# EAGLE design steerstick_power (EAGLE 9.6.2)
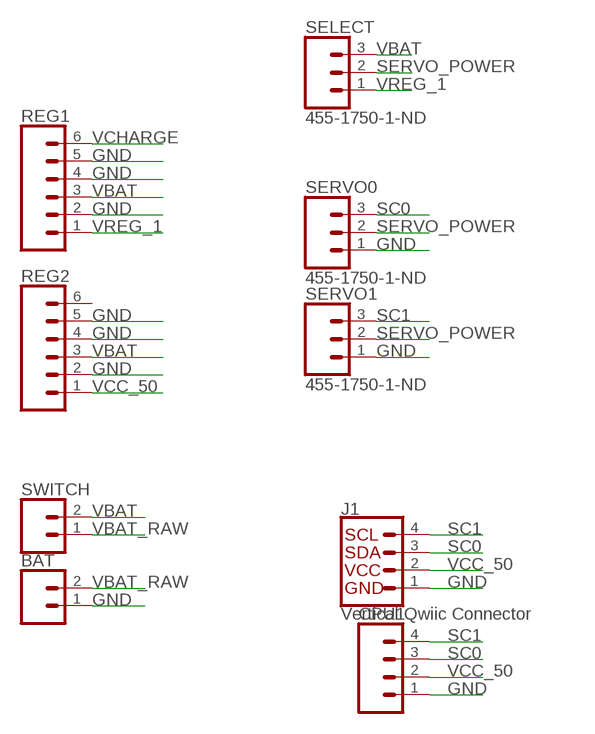
[diagram p0: schematic, sheet 1]

## Parts
BAT  CONN_02  [1X02]
CPU1  CONN_041X04_NO_SILK  [1X04_NO_SILK]
J1  Vertical Qwiic Connector  QWIIC_CONNECTOR  [JST04_1MM_VERT]
REG1  CONN_06SILK_FEMALE_PTH  [1X06]
REG2  CONN_06SILK_FEMALE_PTH  [1X06]
SELECT  455-1750-1-ND  CONN_03  [1X03]
SERVO0  455-1750-1-ND  CONN_03  [1X03]
SERVO1  455-1750-1-ND  CONN_03  [1X03]
SWITCH  CONN_02  [1X02]

## Nets
GND: BAT.1 CPU1.1 J1.1 REG1.2 REG1.4 REG1.5 REG2.2 REG2.4 REG2.5 SERVO0.1 SERVO1.1
SC0: CPU1.3 J1.3 SERVO0.3
SC1: CPU1.4 J1.4 SERVO1.3
SERVO_POWER: SELECT.2 SERVO0.2 SERVO1.2
VBAT: REG1.3 REG2.3 SELECT.3 SWITCH.2
VBAT_RAW: BAT.2 SWITCH.1
VCC_50: CPU1.2 J1.2 REG2.1
VCHARGE: REG1.6
VREG_1: REG1.1 SELECT.1
Unconnected: REG2.6

## Library data of the parts
BAT SWITCH = SparkFun-Connectors:CONN_02: Multi connection point. Often used as Generic Header-pin footprint for 0.1 inch spaced/style header connections On any of the 0.1 inch spaced packages, you can populate with these: Break Away Headers - Straight <https://www.sparkfun.com/products/116> (PRT-00116) Break Away Male Headers - Right Angle <https://www.sparkfun.com/products/553> (PRT-00553) Female Headers <https://www.sparkfun.com/products/115> (PRT-00115) Break Away Headers - Machine Pin <https://www.sparkfun.com/products/117> (PRT-00117) Break Away Female Headers - Swiss Machine Pin <https://www.sparkfun.com/products/743> (PRT-00743) For SCREWTERMINALS and SPRING TERMINALS visit here: Screw Terimnals on SparkFun.com <https://www.sparkfun.com/search/results?term=Screw+Terminals> (5mm/3.5mm/2.54mm spacing) This device is also useful as a general connection point to wire up your design to another part of your project. Our various solder wires solder well into these plated through hole pads. Hook-Up Wire - Assortment (Stranded, 22 AWG) <https://www.sparkfun.com/products/11375> (PRT-11375) Hook-Up Wire - Assortment (Solid Core, 22 AWG) <https://www.sparkfun.com/products/11367> (PRT-11367) View the entire wire category on our website here <https://www.sparkfun.com/categories/141> Special notes: Molex polarized connector foot print use with: PRT-08233 with associated crimp pins and housings. 2.54_SCREWTERM for use with PRT-10571. 3.5mm Screw Terminal footprints for PRT-08084 5mm Screw Terminal footprints for use with PRT-08432
CPU1 = SparkFun-Connectors:CONN_04: Multi connection point. Often used as Generic Header-pin footprint for 0.1 inch spaced/style header connections On any of the 0.1 inch spaced packages, you can populate with these: Break Away Headers - Straight <https://www.sparkfun.com/products/116> (PRT-00116) Break Away Male Headers - Right Angle <https://www.sparkfun.com/products/553> (PRT-00553) Female Headers <https://www.sparkfun.com/products/115> (PRT-00115) Break Away Headers - Machine Pin <https://www.sparkfun.com/products/117> (PRT-00117) Break Away Female Headers - Swiss Machine Pin <https://www.sparkfun.com/products/743> (PRT-00743) For SCREWTERMINALS and SPRING TERMINALS visit here: Screw Terimnals on SparkFun.com <https://www.sparkfun.com/search/results?term=Screw+Terminals> (5mm/3.5mm/2.54mm spacing) This device is also useful as a general connection point to wire up your design to another part of your project. Our various solder wires solder well into these plated through hole pads. Hook-Up Wire - Assortment (Stranded, 22 AWG) <https://www.sparkfun.com/products/11375> (PRT-11375) Hook-Up Wire - Assortment (Solid Core, 22 AWG) <https://www.sparkfun.com/products/11367> (PRT-11367) View the entire wire category on our website here <https://www.sparkfun.com/categories/141> Special notes: Molex polarized connector foot print use with SKU : PRT-08231 with associated crimp pins and housings. 1MM SMD Version SKU: PRT-10208; PROD_ID: CONN-09696
J1 = SparkFun-Connectors:QWIIC_CONNECTOR: SparkFun I2C Standard Qwiic Connector An SMD 1mm pitch JST connector makes it easy and quick (get it? Qwiic?) to connect I2C devices to each other. The Qwiic system <http://www.sparkfun.com/qwiic> enables fast and solderless connection between popular platforms and various sensors and actuators. We carry 200mm <https://www.sparkfun.com/products/14204>, 100mm <https://www.sparkfun.com/products/14205>, 50mm <https://www.sparkfun.com/products/14206>, and breadboard friendly <https://www.sparkfun.com/products/14207> Qwiic cables. We also offer 10 pcs strips <https://www.sparkfun.com/products/14323> the SMD connectors.; PROD_ID: CONN-14483
REG1 REG2 = SparkFun-Connectors:CONN_06: Multi connection point. Often used as Generic Header-pin footprint for 0.1 inch spaced/style header connections On any of the 0.1 inch spaced packages, you can populate with these: Break Away Headers - Straight <https://www.sparkfun.com/products/116> (PRT-00116) Break Away Male Headers - Right Angle <https://www.sparkfun.com/products/553> (PRT-00553) Female Headers <https://www.sparkfun.com/products/115> (PRT-00115) Break Away Headers - Machine Pin <https://www.sparkfun.com/products/117> (PRT-00117) Break Away Female Headers - Swiss Machine Pin <https://www.sparkfun.com/products/743> (PRT-00743) Arduino Stackable Header - 6 Pin <https://www.sparkfun.com/products/9280> (PRT-09280) For SCREWTERMINALS and SPRING TERMINALS visit here: Screw Terimnals on SparkFun.com <https://www.sparkfun.com/search/results?term=Screw+Terminals> (5mm/3.5mm/2.54mm spacing) This device is also useful as a general connection point to wire up your design to another part of your project. Our various solder wires solder well into these plated through hole pads. Hook-Up Wire - Assortment (Stranded, 22 AWG) <https://www.sparkfun.com/products/11375> (PRT-11375) Hook-Up Wire - Assortment (Solid Core, 22 AWG) <https://www.sparkfun.com/products/11367> (PRT-11367) View the entire wire category on our website here <https://www.sparkfun.com/categories/141>; PROD_ID: CONN-08437
SELECT SERVO0 SERVO1 = SparkFun-Connectors:CONN_03: Multi connection point. Often used as Generic Header-pin footprint for 0.1 inch spaced/style header connections On any of the 0.1 inch spaced packages, you can populate with these: Break Away Headers - Straight <https://www.sparkfun.com/products/116> (PRT-00116) Break Away Male Headers - Right Angle <https://www.sparkfun.com/products/553> (PRT-00553) Female Headers <https://www.sparkfun.com/products/115> (PRT-00115) Break Away Headers - Machine Pin <https://www.sparkfun.com/products/117> (PRT-00117) Break Away Female Headers - Swiss Machine Pin <https://www.sparkfun.com/products/743> (PRT-00743) Stackable Header - 3 Pin (Female, 0.1") <https://www.sparkfun.com/products/13875> (PRT-13875) For SCREWTERMINALS and SPRING TERMINALS visit here: Screw Terimnals on SparkFun.com <https://www.sparkfun.com/search/results?term=Screw+Terminals> (5mm/3.5mm/2.54mm spacing) This device is also useful as a general connection point to wire up your design to another part of your project. Our various solder wires solder well into these plated through hole pads. Hook-Up Wire - Assortment (Stranded, 22 AWG) <https://www.sparkfun.com/products/11375> (PRT-11375) Hook-Up Wire - Assortment (Solid Core, 22 AWG) <https://www.sparkfun.com/products/11367> (PRT-11367) View the entire wire category on our website here <https://www.sparkfun.com/categories/141> Special notes: Molex polarized connector foot print use with SKU : PRT-08232 with associated crimp pins and housings.; PROD_ID: XXX-00000

## Board
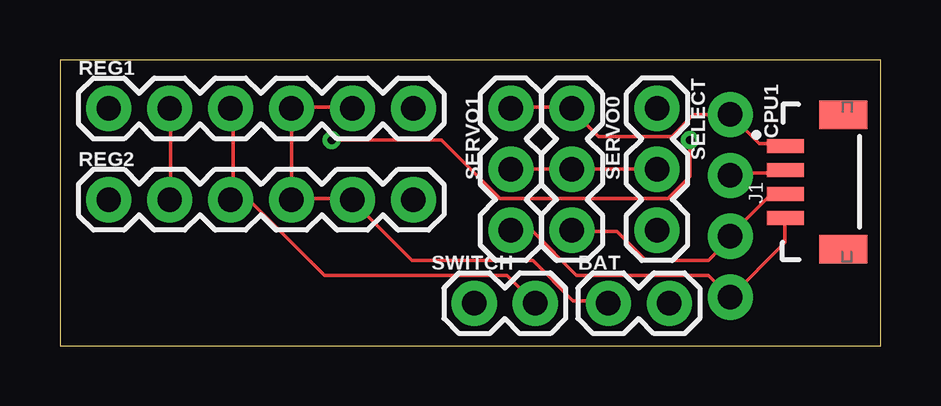
[diagram p1: board, top side]
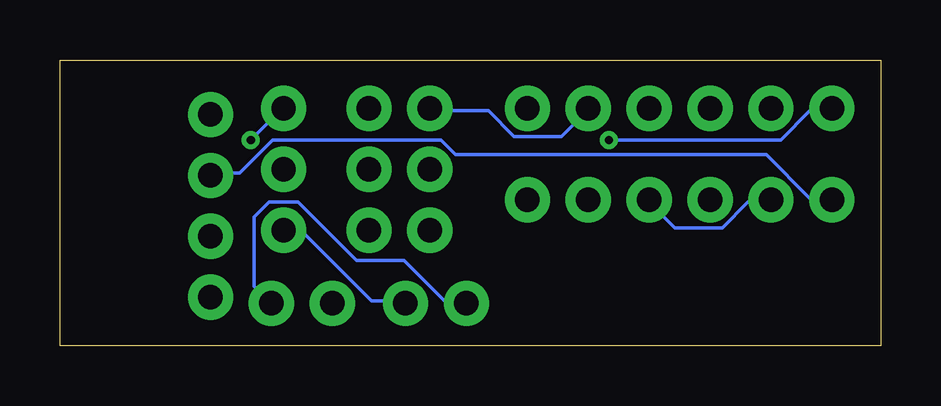
[diagram p2: board, bottom side, seen from below]

Size 34.21 x 11.93 mm. Coordinates in mm from the lower left corner, seen from the top.
Outline: 0,0 34.21,0 34.21,11.93 0,11.93 0,0
Copper layers (1*16): Top 0.035mm / dielectric 1.5mm / Bottom 0.035mm
Design rules "default": minimum track width 6mil, minimum drill 0.35mm, track to track 6mil, track to pad 6mil, pad to pad 6mil, via to via 6mil, smd to smd 6mil, copper to edge 40mil, drill to drill 6mil, minimum pad ring 10mil, minimum via ring 8mil, stop-mask expansion 4mil, vias tented up to drill 0mil, thermal gap 10mil

### Footprints (pad centres in the part's own frame; a part is rotated, then mirrored left to right if it is on the bottom)
1X02 = drill 1.016 pad 1.88: 1 0,0; 2 2.54,0
1X04_NO_SILK = drill 1.016 pad 1.88: 1 0,0; 2 2.54,0; 3 5.08,0; 4 7.62,0
JST04_1MM_VERT = smd 0.6 x 1.55: 1 -1.478,0.775; 2 -0.478,0.775; 3 0.522,0.775; 4 1.522,0.775 | smd 1.2 x 2: NC1 -2.778,3.2; NC2 2.822,3.2
1X06 = drill 1.016 pad 1.88: 1 0,0; 2 2.54,0; 3 5.08,0; 4 7.62,0; 5 10.16,0; 6 12.7,0
1X03 = drill 1.016 pad 1.88: 1 0,0; 2 2.54,0; 3 5.08,0

### Placement (x,y rotation side)
BAT  22.86,1.78 0 top
CPU1  27.94,9.65 270 top
J1  29.46,6.86 270 top
REG1  2.03,9.91 0 top
REG2  2.03,6.1 0 top
SELECT  24.89,9.91 270 top
SERVO0  21.34,9.91 270 top
SERVO1  18.8,9.91 270 top
SWITCH  17.27,1.78 0 top

### Tracks (layer width: path | path; a pad name or v marks a point on that pad's centre or on a via)
GND
  Top 0.152: J1.1 30.23,8.43 29.16,8.43 CPU1.1 26.42,9.65 25.5,8.74 22.45,8.74 21.39,9.8 SERVO0.1 21.23,9.96 18.8,9.96 SERVO1.1 | REG2.2 4.62,6.15 4.62,9.8 REG1.2 | REG1.5 12.09,9.96 9.65,9.96 REG1.4 9.65,6.15 | 9.65,6.15 12.09,6.15 REG2.5 12.24,5.99 14.68,3.56 19.71,3.56 21.39,1.88 22.76,1.88 BAT.1 | 9.65,6.15 REG2.4
  Bottom 0.152: REG2.2 4.62,5.99 5.54,5.99 6.6,4.93 8.58,4.93 9.65,5.99 REG2.4 | SERVO1.1 18.8,9.8 16.36,9.8 15.29,8.74 13.31,8.74 12.24,9.8 REG1.5
SC0
  Top 0.152: J1.3 30.23,6.3 29.62,6.3 27.94,4.62 CPU1.3 27.94,4.47 27.03,3.56 24.44,3.56 23.22,4.78 21.39,4.78 SERVO0.3
SC1
  Top 0.152: J1.4 30.23,5.23 30.23,4.32 CPU1.4 27.03,2.95 21.54,2.95 19.71,4.78 18.8,4.78 SERVO1.3
SERVO_POWER
  Top 0.152: SERVO1.2 SERVO0.2 SELECT.2
VBAT
  Top 0.152: REG1.3 7.21,9.8 7.21,6.15 REG2.3 7.21,5.99 7.98,5.99 11.02,2.95 18.64,2.95 SWITCH.2
  Bottom 0.152: SWITCH.2 19.86,1.88 21.23,1.88 24.13,4.78 24.89,4.78 SELECT.3
VBAT_RAW
  Bottom 0.152: BAT.2 26.11,2.49 26.11,5.38 25.5,5.99 24.28,5.99 21.84,3.56 19.86,3.56 18.19,1.88 17.27,1.88 SWITCH.1
VCC_50
  Top 0.152: J1.2 30.23,7.21 27.94,7.21 CPU1.2
  Bottom 0.152: REG2.1 2.03,6.15 2.95,6.15 4.78,7.98 17.73,7.98 18.34,8.58 25.35,8.58 26.72,7.21 27.94,7.21 CPU1.2
VREG_1  (via drill 0.35)
  Top 0.152: v11.33,8.58 15.9,8.58 18.34,6.15 25.35,6.15 26.26,7.06 v26.26,8.58
  Bottom 0.152: v11.33,8.58 4.17,8.58 2.95,9.8 2.03,9.8 REG1.1 | v26.26,8.58 24.89,9.96 SELECT.1